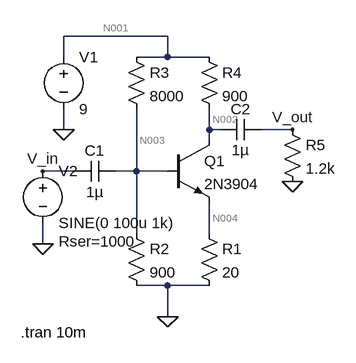
[diagram p0: schematic Draft2.asc]
Draft2.asc, the LTspice schematic file:
Version 4
SHEET 1 880 680
WIRE 112 -32 -48 -32
WIRE -48 0 -48 -32
WIRE 112 0 112 -32
WIRE 112 0 64 0
WIRE 176 0 112 0
WIRE -48 112 -48 80
WIRE 176 112 176 80
WIRE 192 112 176 112
WIRE 304 112 256 112
WIRE 176 128 176 112
WIRE -32 176 -80 176
WIRE 64 176 64 80
WIRE 64 176 32 176
WIRE 112 176 64 176
WIRE 64 272 64 176
WIRE 176 272 176 224
WIRE -80 288 -80 256
WIRE 112 352 64 352
WIRE 176 352 112 352
WIRE 112 400 112 352
FLAG 112 400 0
FLAG -48 112 0
FLAG 304 192 0
FLAG -80 288 0
FLAG 304 112 V_out
FLAG -80 176 V_in
SYMBOL npn 112 128 R0
SYMATTR InstName Q1
SYMATTR Value 2N3904
SYMBOL res 160 256 R0
SYMATTR InstName R1
SYMATTR Value 20
SYMBOL res 48 256 R0
SYMATTR InstName R2
SYMATTR Value 900
SYMBOL res 48 -16 R0
SYMATTR InstName R3
SYMATTR Value 8000
SYMBOL res 160 -16 R0
SYMATTR InstName R4
SYMATTR Value 900
SYMBOL voltage -48 -16 R0
WINDOW 123 0 0 Left 2
WINDOW 39 0 0 Left 2
SYMATTR InstName V1
SYMATTR Value 9
SYMBOL res 288 96 R0
SYMATTR InstName R5
SYMATTR Value 1.2k
SYMBOL voltage -80 160 R0
WINDOW 123 0 0 Left 2
WINDOW 39 24 124 Left 2
SYMATTR InstName V2
SYMATTR Value SINE(0 100u 1k)
SYMATTR SpiceLine Rser=1000
SYMBOL cap 32 160 R90
WINDOW 0 0 32 VBottom 2
WINDOW 3 32 32 VTop 2
SYMATTR InstName C1
SYMATTR Value 1µ
SYMBOL cap 256 96 R90
WINDOW 0 0 32 VBottom 2
WINDOW 3 32 32 VTop 2
SYMATTR InstName C2
SYMATTR Value 1µ
TEXT -114 424 Left 2 !.tran 10m

The netlist it stands for:
* Draft2.asc
Q1 N002 N003 N004 0 2N3904
R1 N004 0 20
R2 N003 0 900
R3 N001 N003 8000
R4 N001 N002 900
V1 N001 0 9
R5 V_out 0 1.2k
V2 V_in 0 SINE(0 100u 1k) Rser=1000
C1 N003 V_in 1µ
C2 V_out N002 1µ
.model NPN NPN
.model PNP PNP
.lib standard.bjt
.tran 10m
.backanno
.end

* Results of the author's LTspice run, read from the files saved beside the schematic
* Operating Point, zero values left out:
*   V(n002) = 1.217 V
*   V(n003) = 886.4 mV
*   V(n004) = 173.5 mV
*   V(n001) = 9 V
*   Ic(Q1) = 8.647 mA
*   Ib(Q1) = 29.35 µA
*   Ie(Q1) = -8.677 mA
*   I(R4) = 8.647 mA
*   I(R3) = 1.014 mA
*   I(R2) = 984.9 µA
*   I(R1) = 8.677 mA
*   I(V1) = -9.662 mA
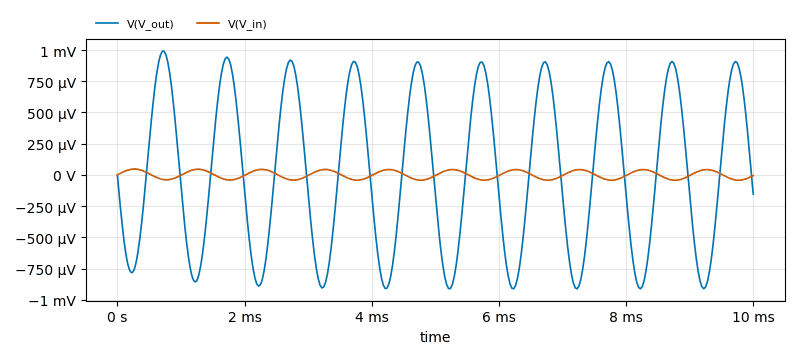
[diagram p1: Transient Analysis of Draft2.asc, plotted from the saved traces]
* Transient Analysis, 1 run:
*   V(V_out): min -912.6 µV, max 990.5 µV, average 14.57 µV, rms 642.3 µV, last -153.7 µV
*   V(V_in): min -42.54 µV, max 47.18 µV, average 914.7 nV, rms 30.33 µV, last -5.328 µV